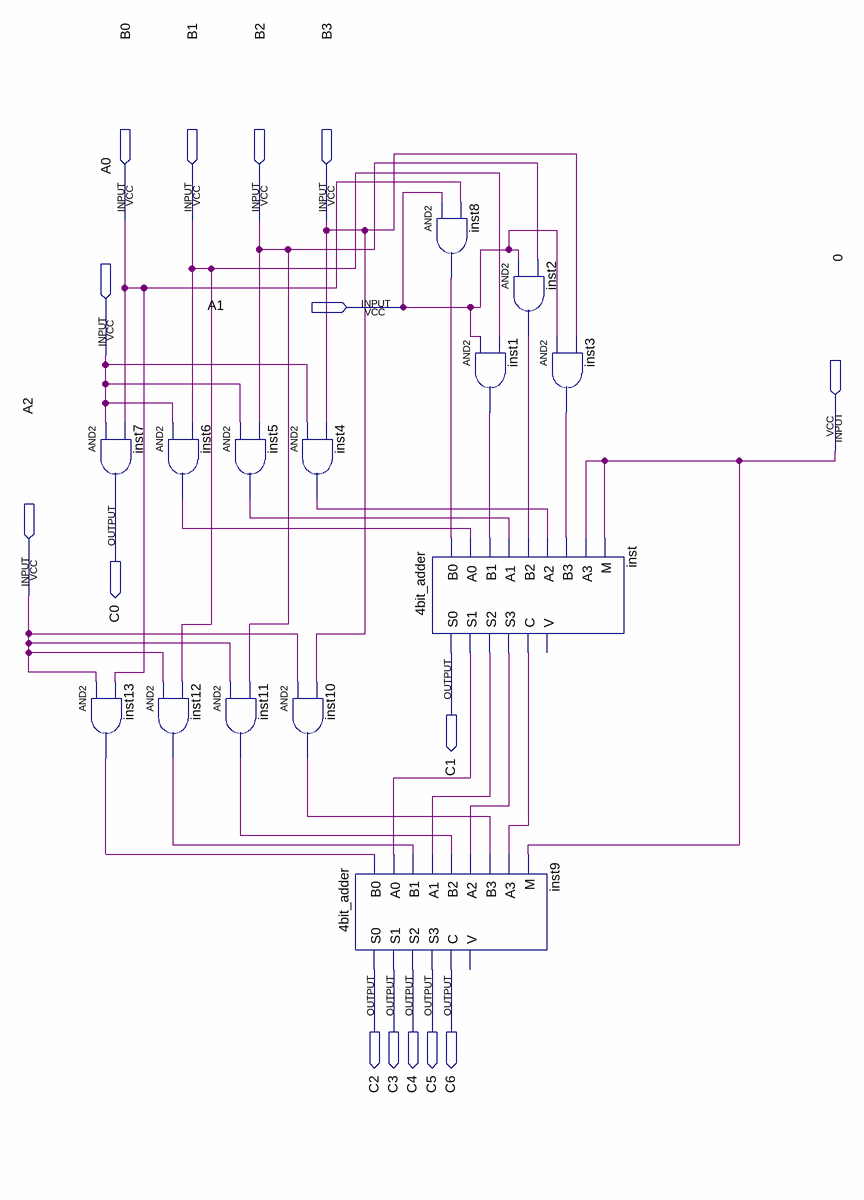
[diagram p0: schematic sheet]
// Quartus schematic s1113341_lab03_bonus.bdf as structural Verilog: 14 symbols, 15 pins
module s1113341_lab03_bonus (
  input  B0,
  input  B1,
  input  B2,
  input  B3,
  input  A1,
  input  A0,
  input  \0 ,
  input  A2,
  output C0,
  output C1,
  output C2,
  output C3,
  output C4,
  output C5,
  output C6
);

  wire inst1_out, inst2_out, inst3_out, inst4_out, inst5_out, inst6_out, inst8_out, inst10_out, inst11_out,
       inst12_out, inst13_out, inst_c, inst_s1, inst_s2, inst_s3;

  and inst7 (C0, A0, B0);
  and inst13 (inst13_out, A2, B0);
  and inst6 (inst6_out, A0, B1);
  and inst12 (inst12_out, A2, B1);
  and inst5 (inst5_out, A0, B2);
  and inst11 (inst11_out, A2, B2);
  and inst4 (inst4_out, A0, B3);
  and inst10 (inst10_out, A2, B3);
  \4bit_adder  inst9 (
    .B0(inst13_out), .A0(inst_s1), .B1(inst12_out), .A1(inst_s2), .B2(inst11_out), .A2(inst_s3),
    .B3(inst10_out), .A3(inst_c), .M(\0 ), .S0(C2), .S1(C3), .S2(C4), .S3(C5), .C(C6));  // open: V
  and inst8 (inst8_out, A1, B0);
  and inst1 (inst1_out, A1, B1);
  \4bit_adder  inst (
    .B0(inst8_out), .A0(inst6_out), .B1(inst1_out), .A1(inst5_out), .B2(inst2_out), .A2(inst4_out),
    .B3(inst3_out), .A3(\0 ), .M(\0 ), .S0(C1), .S1(inst_s1), .S2(inst_s2), .S3(inst_s3), .C(inst_c));  // open: V
  and inst2 (inst2_out, A1, B2);
  and inst3 (inst3_out, A1, B3);
endmodule
